# EAGLE schematic steth-headphone (EAGLE 6.5.0)
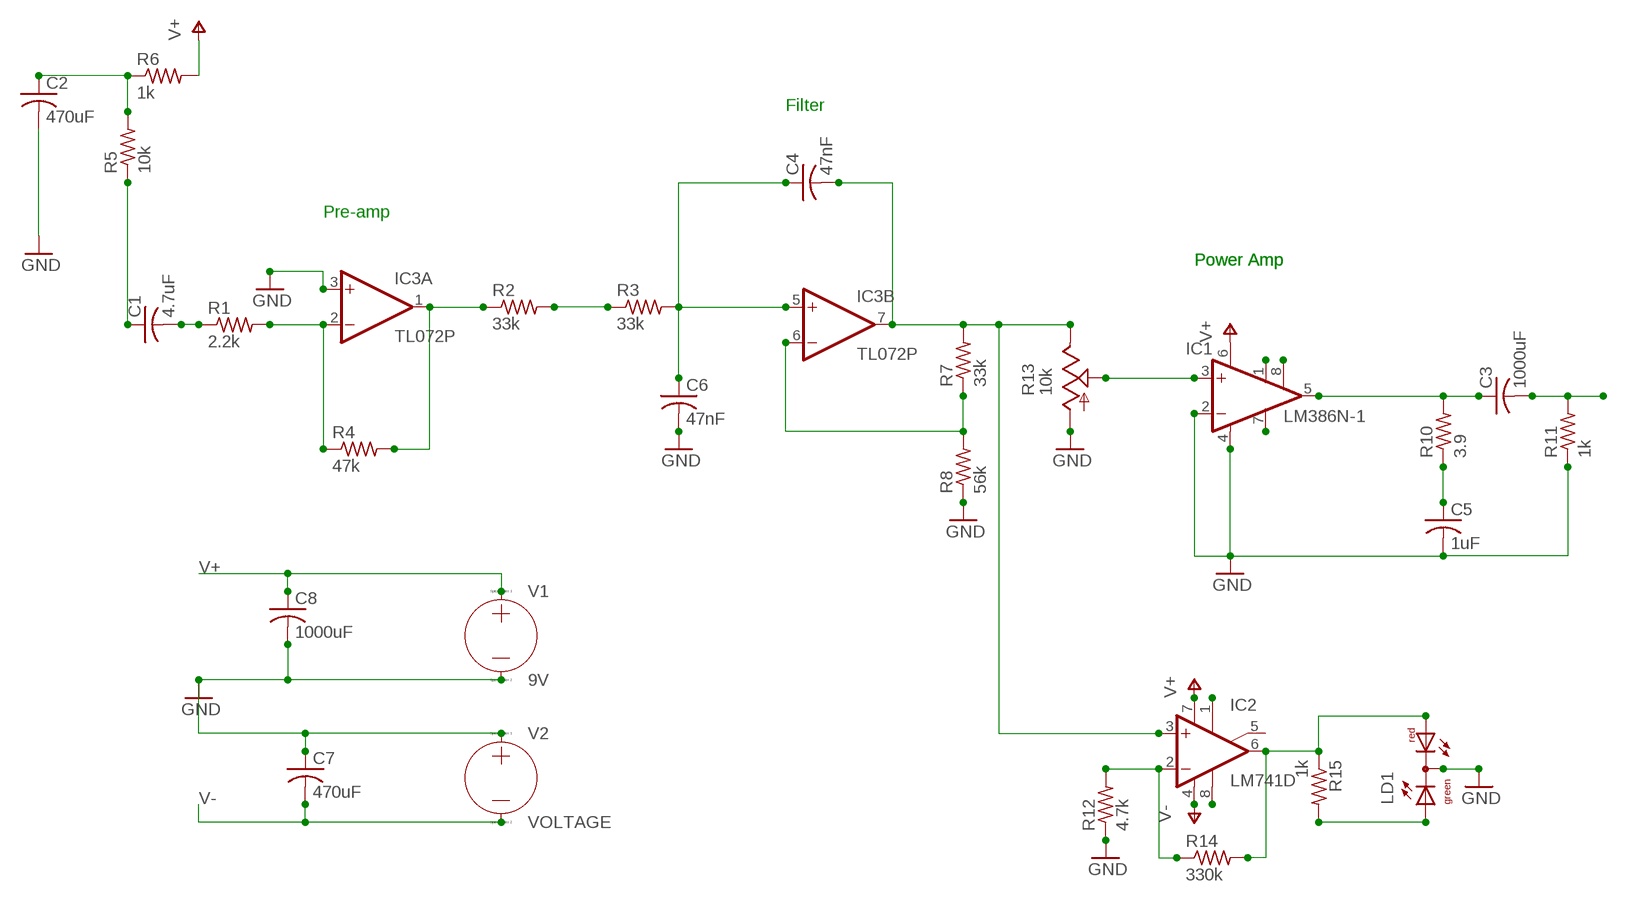
[diagram p0: schematic, sheet 1]

## Parts
C1  4.7uF  C-US025-050X050  [C025-050X050]
C2  470uF  C-US025-050X050  [C025-050X050]
C3  1000uF  C-US025-050X050  [C025-050X050]
C4  47nF  C-US025-050X050  [C025-050X050]
C5  1uF  C-US025-050X050  [C025-050X050]
C6  47nF  C-US025-050X050  [C025-050X050]
C7  470uF  C-US025-050X050  [C025-050X050]
C8  1000uF  C-US025-050X050  [C025-050X050]
IC1  LM386N-1  [DIL08]
IC2  LM741D  [SO08]
IC3  TL072P  [DIL08]
LD1  DUOLED-RG-C  [DUOLED-C-5MM]
R1  2.2k  R-US_0309/12  [0309/12]
R2  33k  R-US_0309/12  [0309/12]
R3  33k  R-US_0309/12  [0309/12]
R4  47k  R-US_0309/12  [0309/12]
R5  10k  R-US_0309/12  [0309/12]
R6  1k  R-US_0309/12  [0309/12]
R7  33k  R-US_0309/12  [0309/12]
R8  56k  R-US_0309/12  [0309/12]
R10  3.9  R-US_0309/12  [0309/12]
R11  1k  R-US_0309/12  [0309/12]
R12  4.7k  R-US_0309/12  [0309/12]
R13  10k  TRIM_US-B25U  [B25U]
R14  330k  R-US_0411/12  [0411/12]
R15  1k  R-US_0411/12  [0411/12]
V1  9V  VOLTAGE  (no package)
V2  VOLTAGE  (no package)

## Nets
GND: C2.2 C5.2 C6.2 C7.1 C8.2 IC1.2(-IN) IC1.4(GND) IC3.3(A:+IN) LD1.C R8.1 R11.1 R12.1 R13.A V1.- V2.+
N$1: C2.1 R5.2 R6.1
N$3: IC2.1(ON1)
N$4: C8.1 V1.+
N$6: C7.2 V2.-
N$7: C1.1 R5.1
N$9: C1.2 R1.1
N$10: IC3.2(A:-IN) R1.2 R4.1
N$11: IC2.8(OPT)
N$12: IC2.2(-IN) R12.2 R14.1
N$13: IC3.1(A:OUT) R2.1 R4.2
N$17: IC2.6(OUT) LD1.AR R14.2 R15.1
N$18: R2.2 R3.1
N$20: LD1.AX(AG) R15.2
N$25: IC3.6(B:-IN) R7.1 R8.2
N$29: IC1.3(+IN) R13.S
N$33: IC1.7(BYPASS)
N$35: IC1.1(GAIN)
N$36: IC1.8(GAIN)
N$37: C3.1 IC1.5(OUT) R10.2
N$41: C5.1 R10.1
N$45: C3.2 R11.2
N$47: C4.1 C6.1 IC3.5(B:+IN) R3.2
N$49: C4.2 IC2.3(+IN) IC3.7(B:OUT) R7.2 R13.E
V+: IC1.6(VS) IC2.7(V+) R6.2
V-: IC2.4(V-)
Unconnected: IC2.5(ON2)

## Notes on the sheet
- Filter
- Pre-amp
- Power Amp | Power Amp

## Power pins joined to a net without a drawn wire
V+: IC3.8(P:V+)
V-: IC3.4(P:V-)

## Library data of the parts
C1-C8 = resistor:C-US: CAPACITOR, American symbol
IC1 = linear:LM386?-*: Low Voltage Audio Power Amplifier Source: http://cache.national.com/ds/LM/LM386.pdf
IC2 = linear:*741: OP AMP
IC3 = linear:TL072: OP AMP
LD1 = led:DUOLED-RG-C: DUO LED 2 colors (red/green), 5 mm, round, common Cathode www.ligitek.com or other producers.
R1-R8 R10-R12 R14 R15 = resistor:R-US_: RESISTOR, American symbol
R13 = pot:TRIM_US-: POTENTIOMETER
V1 V2 = lt-spice-simulation:VOLTAGE: Voltage Source, either DC, AC, PULSE, SINE, PWL, EXP, or SFFM